# Altium project eps_alpha-test_boost-mppt.PrjPcb
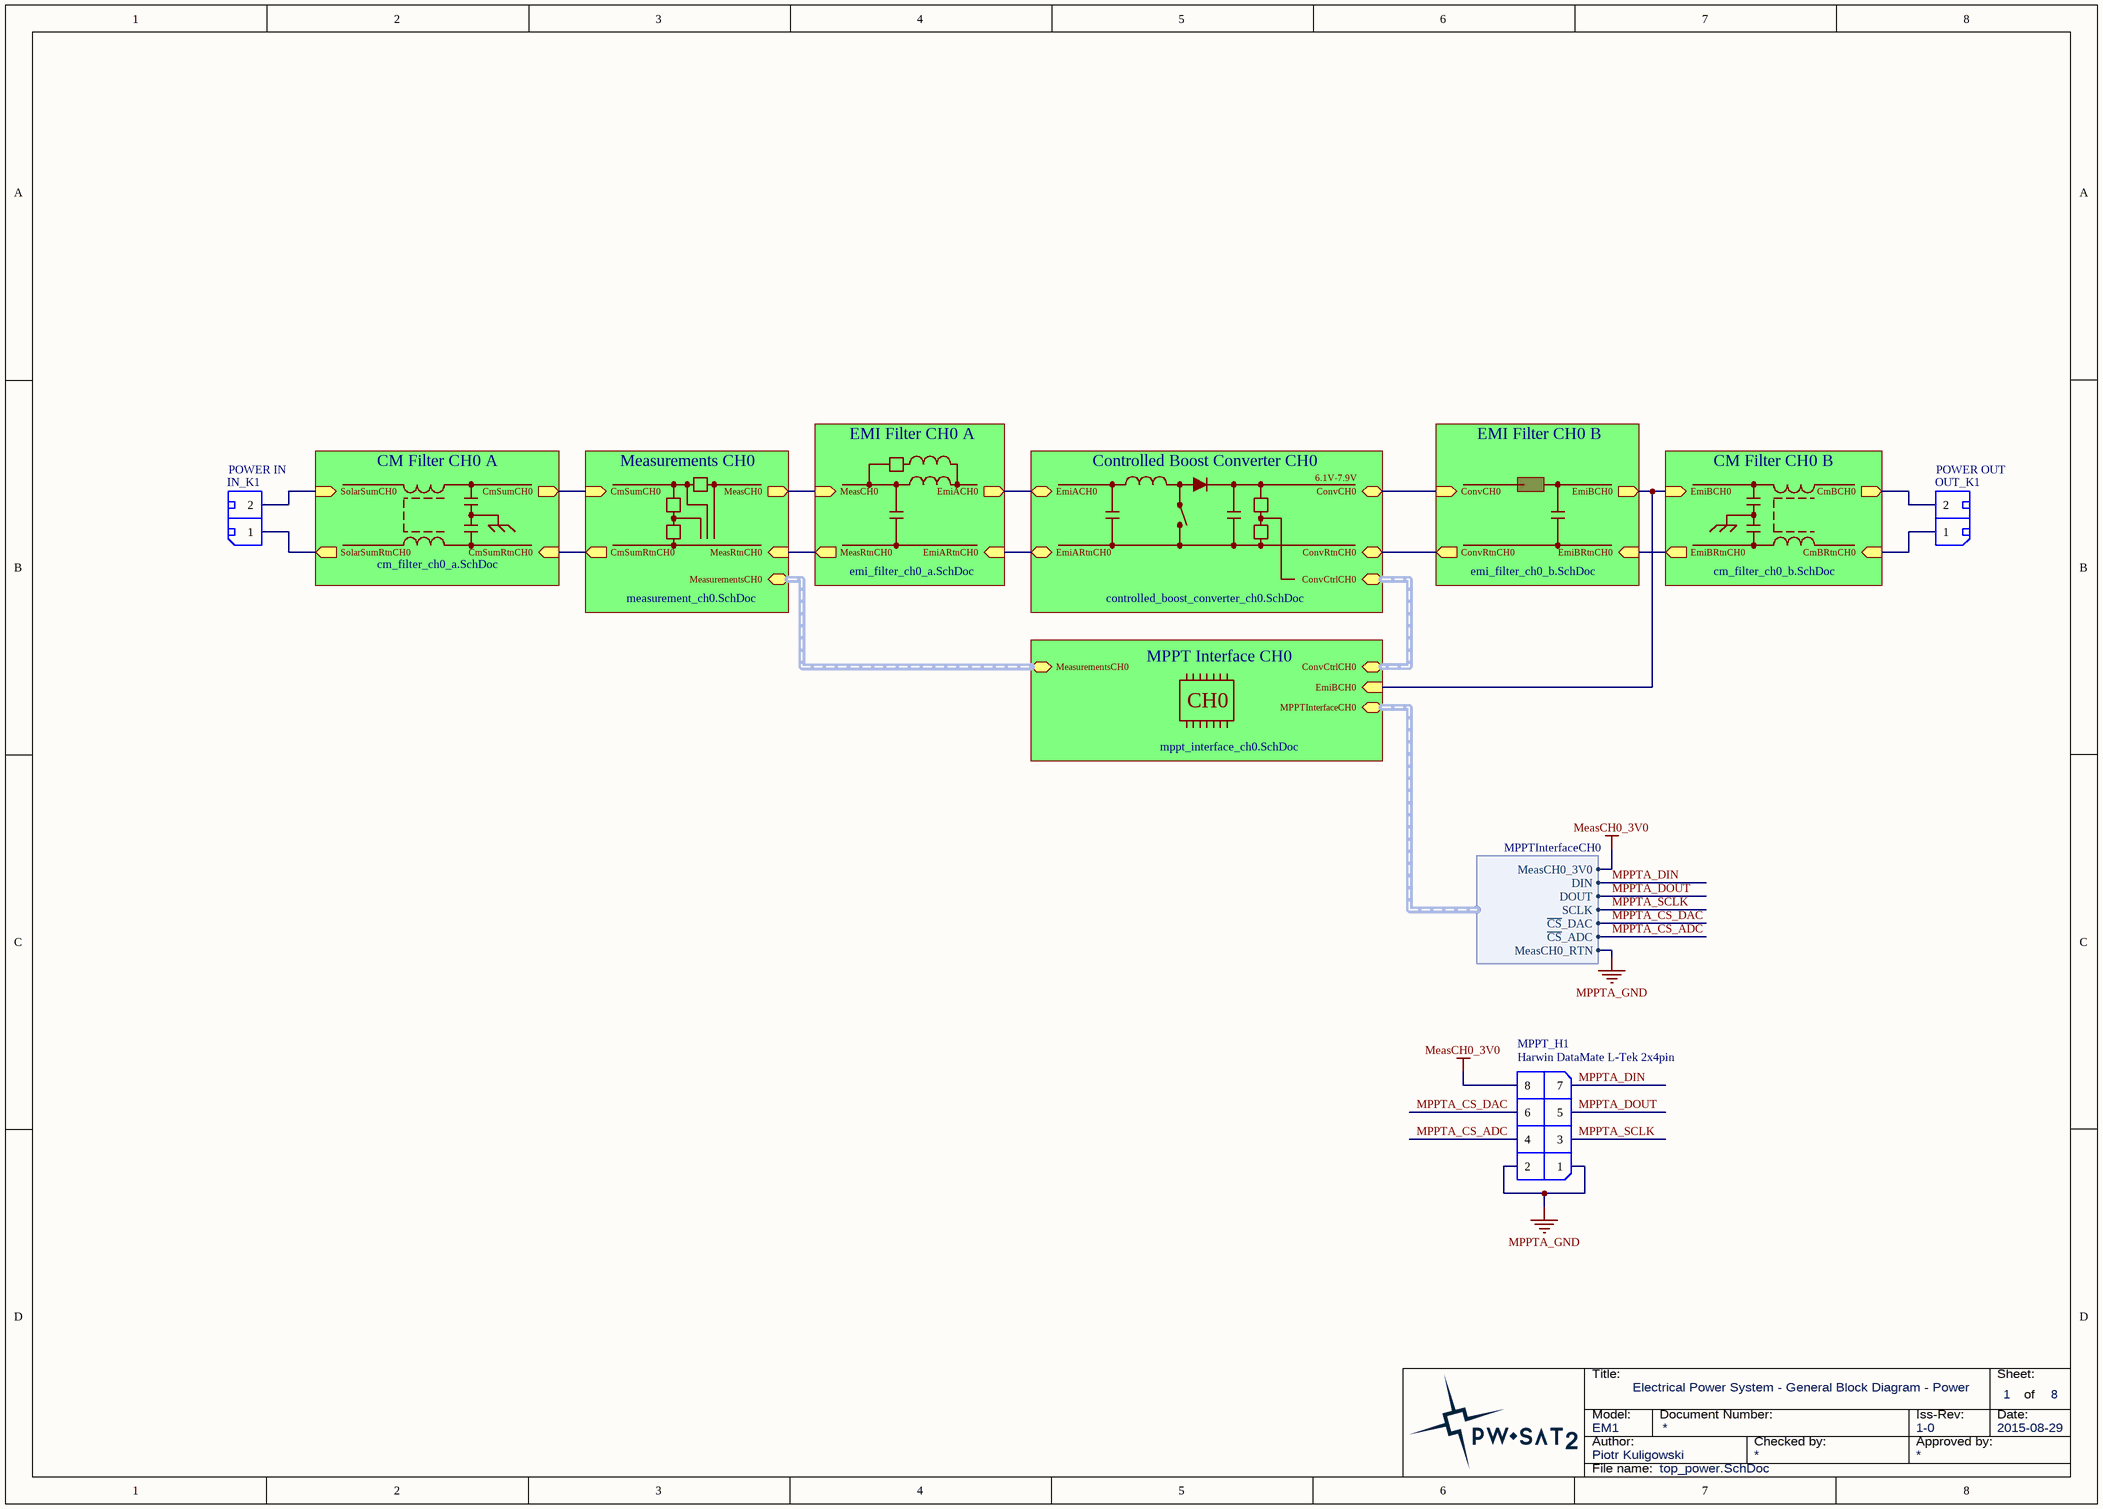
[diagram p0: top_power.SchDoc]
8 sheets, 91 parts. Net scope: hierarchical (ports join the sheet entries above them; power ports are global).
Board file: eps_alpha-test_boost-mppt.PcbDoc
Sheets:
  top_power.SchDoc
    Controlled Boost Converter CH0 = controlled_boost_converter_ch0.SchDoc
    CM Filter CH0 A = cm_filter_ch0_a.SchDoc
    MPPT Interface CH0 = mppt_interface_ch0.SchDoc
    Measurements CH0 = measurement_ch0.SchDoc
    EMI Filter CH0 A = emi_filter_ch0_a.SchDoc
    EMI Filter CH0 B = emi_filter_ch0_b.SchDoc
    CM Filter CH0 B = cm_filter_ch0_b.SchDoc

## Sheet top_power.SchDoc: Electrical Power System - General Block Diagram - Power
size A3; Date: 2015-08-29; Author: Piotr Kuligowski; Revision: 1-0; SheetNumber: 1; SheetTotal: 8; Model: EM1; PageSetup: Record=PageOptions|CenterHorizontal=True|CenterVertical=True|PrintScale=0.52|XCorrection=1.00|YCorrection=1.00|PrintKind=1|BorderSize=5000000|LeftOffset=0|BottomOffset=0|Orientation=2|PaperLength=4200|PaperWidth=2970|Scale=100|PaperSource=7|PrintQuality=600|MediaType=1|DitherType=10|PaperKind=A3|PrintScaleMode=1

### Parts
IN_K1  ProviderPartNumber: POWER IN  [TerminalBlock_Spring_2.54_2-R]  (hidden comment: TB-2.5-PD-xx)
MPPT_H1  Harwin DataMate L-Tek 2x4pin  [Harwin_Datamate_L-Tek_M80-8670805]
OUT_K1  ProviderPartNumber: POWER OUT  [TerminalBlock_Spring_2.54_2-R]  (hidden comment: TB-2.5-PD-xx)

### Sub-sheets
CM Filter CH0 A = cm_filter_ch0_a.SchDoc: CmSumCH0 (out), CmSumRtnCH0 (in), SolarSumCH0 (in), SolarSumRtnCH0 (out)
CM Filter CH0 B = cm_filter_ch0_b.SchDoc: CmBCH0 (out), CmBRtnCH0 (in), EmiBCH0 (in), EmiBRtnCH0 (out)
Controlled Boost Converter CH0 = controlled_boost_converter_ch0.SchDoc: ConvCH0, ConvRtnCH0, EmiACH0, EmiARtnCH0, ConvCtrlCH0 (harness ConvCtrlCH0)
EMI Filter CH0 A = emi_filter_ch0_a.SchDoc: EmiACH0 (out), EmiARtnCH0 (in), MeasCH0 (in), MeasRtnCH0 (out)
EMI Filter CH0 B = emi_filter_ch0_b.SchDoc: EmiBCH0 (out), EmiBRtnCH0 (in), ConvCH0 (in), ConvRtnCH0 (out)
Measurements CH0 = measurement_ch0.SchDoc: MeasCH0 (out), MeasRtnCH0 (in), CmSumCH0 (in), CmSumRtnCH0 (out), MeasurementsCH0 (harness MeasurementsCH0)
MPPT Interface CH0 = mppt_interface_ch0.SchDoc: MeasurementsCH0 (harness MeasurementsCH0), ConvCtrlCH0 (harness ConvCtrlCH0), MPPTInterfaceCH0 (harness MPPTInterfaceCH0), EmiBCH0 (in)

### Harnesses
MPPTInterfaceCH0: DIN, DOUT, SCLK, ~{CS}_DAC, ~{CS}_ADC, MeasCH0_3V0, MeasCH0_RTN

### Nets
MeasCH0_3V0: MPPT_H1.8 ; sheet MPPT Interface CH0/MPPTInterfaceCH0.MeasCH0_3V0
MPPTA_GND: MPPT_H1.1 MPPT_H1.2 ; sheet Controlled Boost Converter CH0/ConvRtnCH0, sheet Controlled Boost Converter CH0/EmiARtnCH0, sheet CM Filter CH0 A/CmSumRtnCH0, sheet Measurements CH0/MeasRtnCH0, sheet Measurements CH0/CmSumRtnCH0, sheet EMI Filter CH0 A/EmiARtnCH0, sheet EMI Filter CH0 A/MeasRtnCH0, sheet EMI Filter CH0 B/EmiBRtnCH0, sheet EMI Filter CH0 B/ConvRtnCH0, sheet CM Filter CH0 B/EmiBRtnCH0, sheet MPPT Interface CH0/MPPTInterfaceCH0.MeasCH0_RTN  [project net DCDCA_GND]
MPPTA_CS_ADC: MPPT_H1.4 ; sheet MPPT Interface CH0/MPPTInterfaceCH0.~{CS}_ADC
MPPTA_CS_DAC: MPPT_H1.6 ; sheet MPPT Interface CH0/MPPTInterfaceCH0.~{CS}_DAC
MPPTA_DIN: MPPT_H1.7 ; sheet MPPT Interface CH0/MPPTInterfaceCH0.DIN
MPPTA_DOUT: MPPT_H1.5 ; sheet MPPT Interface CH0/MPPTInterfaceCH0.DOUT
MPPTA_SCLK: MPPT_H1.3 ; sheet MPPT Interface CH0/MPPTInterfaceCH0.SCLK
NetCMAA_C1_1: sheet CM Filter CH0 A/CmSumCH0, sheet Measurements CH0/CmSumCH0
NetCMAA_T1_1: IN_K1.2 ; sheet CM Filter CH0 A/SolarSumCH0
NetCMAA_T1_2: IN_K1.1 ; sheet CM Filter CH0 A/SolarSumRtnCH0
NetCMAB_C1_1: sheet MPPT Interface CH0/EmiBCH0, sheet EMI Filter CH0 B/EmiBCH0, sheet CM Filter CH0 B/EmiBCH0
NetCMAB_T1_3: OUT_K1.1 ; sheet CM Filter CH0 B/CmBRtnCH0
NetCMAB_T1_4: OUT_K1.2 ; sheet CM Filter CH0 B/CmBCH0
NetDCDCA_C1_1: sheet Controlled Boost Converter CH0/EmiACH0, sheet EMI Filter CH0 A/EmiACH0
NetDCDCA_C4_1: sheet Controlled Boost Converter CH0/ConvCH0, sheet EMI Filter CH0 B/ConvCH0
NetEMIAA_C1_1: sheet Measurements CH0/MeasCH0, sheet EMI Filter CH0 A/MeasCH0

### Buses and harness runs
harness sheet Controlled Boost Converter CH0/ConvCtrlCH0 = sheet MPPT Interface CH0/ConvCtrlCH0
harness sheet Measurements CH0/MeasurementsCH0 = sheet MPPT Interface CH0/MeasurementsCH0

### Notes on the sheet
- 6.1V-7.9V
- CH0
- Title:
- Sheet:
- of
- Author:
- Model:
- Document Number:
- Checked by:
- Iss-Rev:
- Approved by:
- Date:
- File name:

### Library data of the parts
IN_K1 OUT_K1 = TerminalBlock_Spring_2.54_2-R: Terminal block with spring, 2-pin, 2.54mm pitch, right angle.; Provider: TME.eu; Value: TB-2.5-PD-xx
MPPT_H1 = Harwin_Datamate_L-Tek_2x4pin: Harwin DataMate L-Tek, 2mm pitch, 2x4pin.; Value: Harwin DataMate L-Tek 2x4pin

## Sheet controlled_boost_converter_ch0.SchDoc: Controlled Boost Converter CH0
size A3; Date: 2015-10-06; Author: Piotr Kuligowski; Revision: 1-0; SheetNumber: 5; SheetTotal: 8; Model: EM1
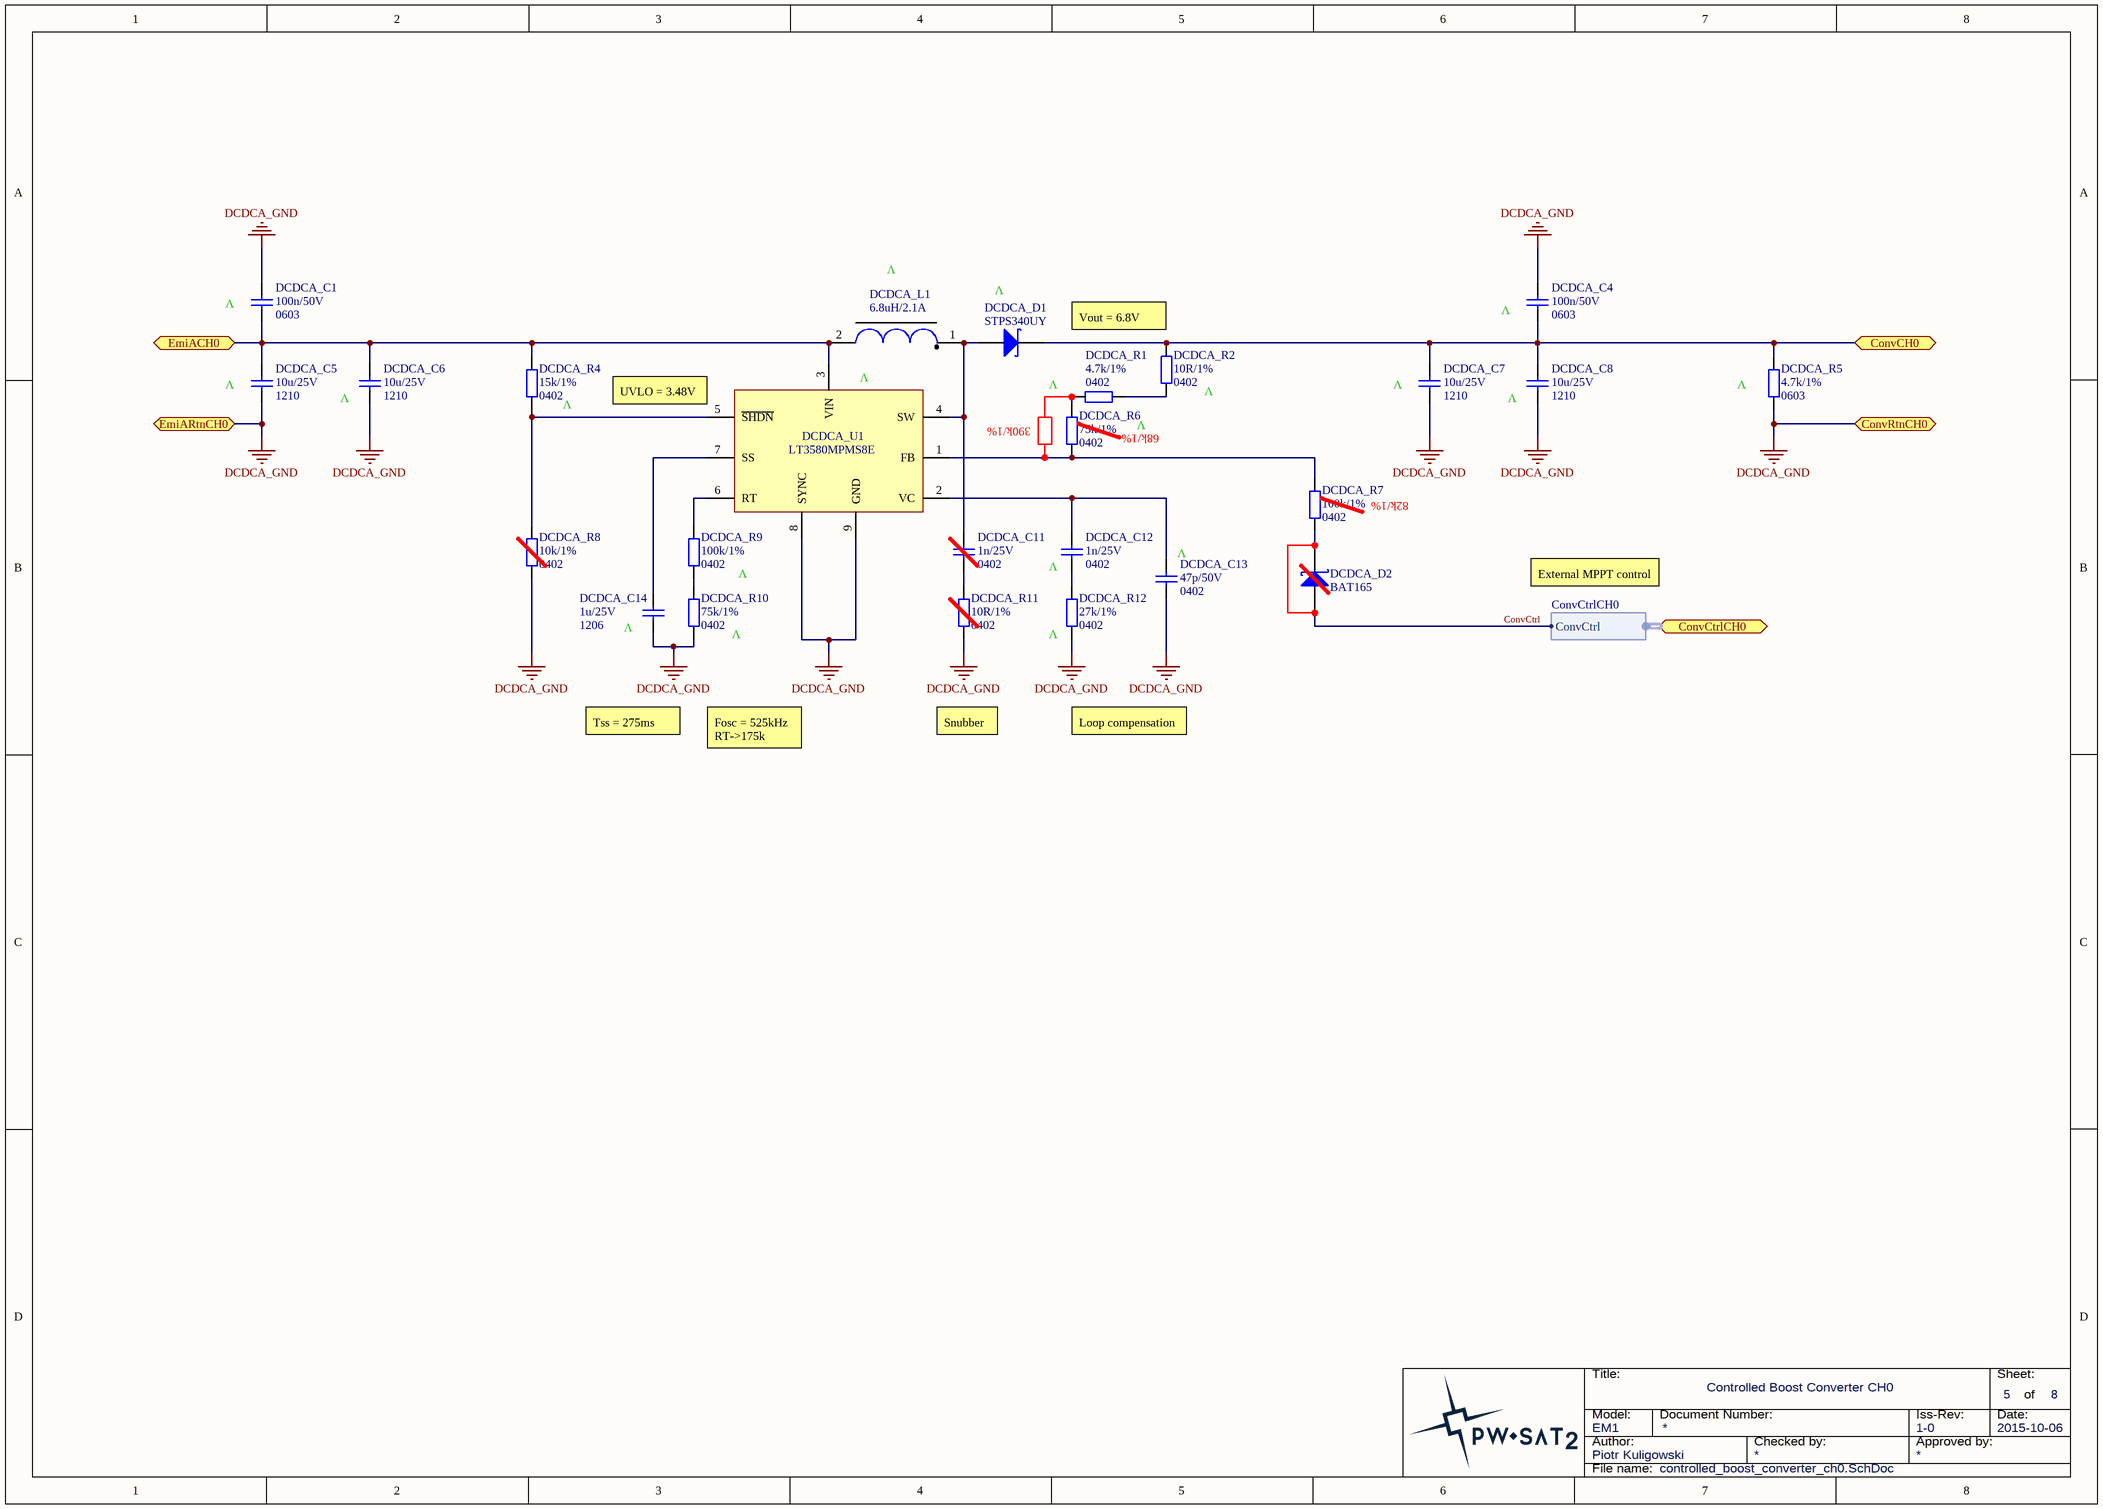
[diagram p1: controlled_boost_converter_ch0.SchDoc]

### Parts
DCDCA_C1  Package: 0603  [SMD_Capacitor_0603]  (hidden comment: 100n/50V)
DCDCA_C4  Package: 0603  [SMD_Capacitor_0603]  (hidden comment: 100n/50V)
DCDCA_C5  Package: 1210  [SMD_Capacitor_1210]  (hidden comment: 10u/25V)
DCDCA_C6  Package: 1210  [SMD_Capacitor_1210]  (hidden comment: 10u/25V)
DCDCA_C7  Package: 1210  [SMD_Capacitor_1210]  (hidden comment: 10u/25V)
DCDCA_C8  Package: 1210  [SMD_Capacitor_1210]  (hidden comment: 10u/25V)
DCDCA_C11  Package: 0402  [SMD_Capacitor_0402]  (hidden comment: 1n/25V)
DCDCA_C12  Package: 0402  [SMD_Capacitor_0402]  (hidden comment: 1n/25V)
DCDCA_C13  Package: 0402  [SMD_Capacitor_0402]  (hidden comment: 47p/50V)
DCDCA_C14  Package: 1206  [SMD_Capacitor_1206]  (hidden comment: 1u/25V)
DCDCA_D1  STPS340UY  [DO-214AA]
DCDCA_D2  BAT165  [SOD323]
DCDCA_L1  6.8uH/2.1A  [Coilcraft_MSS6132]
DCDCA_R1  Package: 0402  [SMD_Resistor_0402]  (hidden comment: 4.7k/1%)
DCDCA_R2  Package: 0402  [SMD_Resistor_0402]  (hidden comment: 10R/1%)
DCDCA_R4  Package: 0402  [SMD_Resistor_0402]  (hidden comment: 15k/1%)
DCDCA_R5  Package: 0603  [SMD_Resistor_0603]  (hidden comment: 4.7k/1%)
DCDCA_R6  Package: 0402  [SMD_Resistor_0402]  (hidden comment: 75k/1%)
DCDCA_R7  Package: 0402  [SMD_Resistor_0402]  (hidden comment: 100k/1%)
DCDCA_R8  Package: 0402  [SMD_Resistor_0402]  (hidden comment: 10k/1%)
DCDCA_R9  Package: 0402  [SMD_Resistor_0402]  (hidden comment: 100k/1%)
DCDCA_R10  Package: 0402  [SMD_Resistor_0402]  (hidden comment: 75k/1%)
DCDCA_R11  Package: 0402  [SMD_Resistor_0402]  (hidden comment: 10R/1%)
DCDCA_R12  Package: 0402  [SMD_Resistor_0402]  (hidden comment: 27k/1%)
DCDCA_U1  (no value)  [LT-MS8E-8-1880X1680TP_N]

### Ports
ConvCH0, ConvCtrlCH0 (harness ConvCtrlCH0), ConvRtnCH0, EmiACH0, EmiARtnCH0

### Harnesses
ConvCtrlCH0: ConvCtrl

### Nets
DCDCA_GND: DCDCA_C1.2 DCDCA_C4.2 DCDCA_C5.2 DCDCA_C6.2 DCDCA_C7.2 DCDCA_C8.2 DCDCA_C13.2 DCDCA_C14.2 DCDCA_R5.2 DCDCA_R8.2 DCDCA_R10.2 DCDCA_R11.2 DCDCA_R12.2 DCDCA_U1.8(SYNC) DCDCA_U1.9(GND) ; port EmiARtnCH0, port ConvRtnCH0
ConvCtrl: DCDCA_D2.A ; port ConvCtrlCH0.ConvCtrl
NetDCDCA_C1_1: DCDCA_C1.1 DCDCA_C5.1 DCDCA_C6.1 DCDCA_L1.2 DCDCA_R4.1 DCDCA_U1.3(VIN) ; port EmiACH0
NetDCDCA_C4_1: DCDCA_C4.1 DCDCA_C7.1 DCDCA_C8.1 DCDCA_D1.K DCDCA_R2.1 DCDCA_R5.1 ; port ConvCH0
NetDCDCA_C11_1: DCDCA_C11.1 DCDCA_D1.A DCDCA_L1.1 DCDCA_U1.4(SW)
NetDCDCA_C11_2: DCDCA_C11.2 DCDCA_R11.1
NetDCDCA_C12_1: DCDCA_C12.1 DCDCA_C13.1 DCDCA_U1.2(VC)
NetDCDCA_C12_2: DCDCA_C12.2 DCDCA_R12.1
NetDCDCA_C14_1: DCDCA_C14.1 DCDCA_U1.7(SS)
NetDCDCA_D2_K: DCDCA_D2.K DCDCA_R7.2
NetDCDCA_R1_1: DCDCA_R1.1 DCDCA_R6.1
NetDCDCA_R1_2: DCDCA_R1.2 DCDCA_R2.2
NetDCDCA_R4_2: DCDCA_R4.2 DCDCA_R8.1 DCDCA_U1.5(~{SHDN})
NetDCDCA_R6_2: DCDCA_R6.2 DCDCA_R7.1 DCDCA_U1.1(FB)
NetDCDCA_R9_1: DCDCA_R9.1 DCDCA_U1.6(RT)
NetDCDCA_R9_2: DCDCA_R9.2 DCDCA_R10.1

### Notes on the sheet
- (near DCDCA_C1) V
- V
- (near DCDCA_D1) V
- (near DCDCA_C4) V
- (near DCDCA_C5) V
- (near DCDCA_U1) V
- (near DCDCA_R2) Vout = 6.8V
- (near DCDCA_R2) V
- (near DCDCA_C7) V
- (near DCDCA_R5) V
- (near DCDCA_C6) V
- (near DCDCA_R4) V
- (near DCDCA_U1) UVLO = 3.48V
- 390k/1%
- 68k/1%
- (near DCDCA_C8) V
- 82k/1%
- (near DCDCA_C12) V
- (near DCDCA_C13) V
- External MPPT control
- (near DCDCA_C14) V
- (near DCDCA_R10) V
- (near DCDCA_R12) V
- Tss = 275ms
- Fosc = 525kHz
  RT->175k
- Snubber
- Loop compensation
- Title:
- Sheet:
- of
- Author:
- Model:
- Document Number:
- Checked by:
- Iss-Rev:
- Approved by:
- Date:
- File name:

### Library data of the parts
DCDCA_C1 DCDCA_C4 = Cer_C0603T104K5RALTU: Ceramic Cap Kemet COTS 100n/50V X7R 0603; Manufacturer: Kemet; ManufacturerPartNumber: C0603T104K5RALTU; Value: 100n/50V
DCDCA_C5-DCDCA_C8 = Cer_GCJ32ER71E106KA12L: Ceramic Cap Murata Automotive 10u/25V X7R 1210; Manufacturer: Murata; ManufacturerPartNumber: GCJ32ER71E106KA12L; Value: 10u/25V
DCDCA_C11 DCDCA_C12 = Cer_C0402T102K3GAL: Ceramic Cap Kemet COTS 1n/25V C0G 0402.; Manufacturer: Kemet; ManufacturerPartNumber: C0402T102K3GAL; Value: 1n/25V
DCDCA_C13 = Cer_GCM1555C1H470JA16D: Ceramic Cap Murata Automotive 47p/50V C0G 0402; Manufacturer: Murata; ManufacturerPartNumber: GCM1555C1H470JA16D; Value: 47p/50V
DCDCA_C14 = Cer_C1206T105K3RALTU: Ceramic Cap Kemet COTS 1u/25V X7R 1206; ManufacturerPartNumber: C1206T105K3RALTU; Manufacturer: Kemet; Value: 1u/25V
DCDCA_D1 = STPS340x: 3A/40V Power Schottky Rectifier.; Manufacturer: STMicroelectronics; Value: STPS340UY
DCDCA_D2 = BAT165: Madium Power AF Schottky 750mA 40V Diode; Manufacturer: Infineon; Value: BAT165
DCDCA_L1 = MSS6132-682MLx: Coilcraft MSS6132 Inductor, L=6.8uH, Irise20deg=2.1A, ESR=52mR, SRF=47MHz.; Manufacturer: Coilcraft; ManufacturerPartNumber: MSS6132-682MLx; Value: 6.8uH/2.1A
DCDCA_R1 = CRCW04024K70FKxxxx: 4.7k/1% Vishay CRCW 0402 Resistor. 63mW, 100ppm, 50V.; ManufacturerPartNumber: CRCW04024K70FKxxxx; Manufacturer: Vishay; Value: 4.7k/1%
DCDCA_R2 DCDCA_R11 = CRCW040210R0FKxxxx: 10R/1% Vishay CRCW 0402 Resistor. 63mW, 100ppm, 50V.; Manufacturer: Vishay; ManufacturerPartNumber: CRCW040210R0FKxxxx; Value: 10R/1%
DCDCA_R4 = CRCW040215K0FKxxxx: 15k/1% Vishay CRCW 0402 Resistor. 63mW, 100ppm, 50V.; Manufacturer: Vishay; ManufacturerPartNumber: CRCW040215K0FKxxxx; Value: 15k/1%
DCDCA_R5 = CRCW06034K70FKxxxx: 4.7k/1% Vishay CRCW 0603 Resistor. 100mW, 100ppm, 75V.; Manufacturer: Vishay; ManufactuerPartNumber: CRCW06034K70FKxxxx; Value: 4.7k/1%
DCDCA_R6 DCDCA_R10 = CRCW040275K0FKxxxx: 75k/1% Vishay CRCW 0402 Resistor. 63mW, 100ppm, 50V.; ManufacturerPartNumber: CRCW040275K0FK; Manufacturer: Vishay; Value: 75k/1%
DCDCA_R7 DCDCA_R9 = CRCW0402100KFKxxxx: 100k/1% Vishay CRCW 0402 Resistor. 63mW, 100ppm, 50V.; Manufacturer: Vishay; ManufacturerPartNumber: CRCW0402100KFKxxxx; Value: 100k/1%
DCDCA_R8 = CRCW040210K0FKxxxx: 10k/1% Vishay CRCW 0402 Resistor. 63mW, 100ppm, 50V.; Manufacturer: Vishay; ManufacturerPartNumber: CRCW040210K0FKxxxx; Value: 10k/1%
DCDCA_R12 = CRCW040227K0FKxxxx: 27k/1% Vishay CRCW 0402 Resistor. 63mW, 100ppm, 50V.; Manufacturer: Vishay; ManufacturerPartNumber: CRCW040227K0FKxxxx; Value: 27k/1%
DCDCA_U1 = LT3580MPMS8E: Boost Conv 2A, Soft-Start, Synchro; Manufacturer: Linear Technology; ManufacturerPartNumber: LT3580MPMS8E

## Sheet cm_filter_ch0_a.SchDoc: Common Mode Filter CH0 A
size A4; Date: 2015-02-21; Author: Piotr Kuligowski; Revision: 1-0; SheetNumber: 2; SheetTotal: 8; Model: EM1
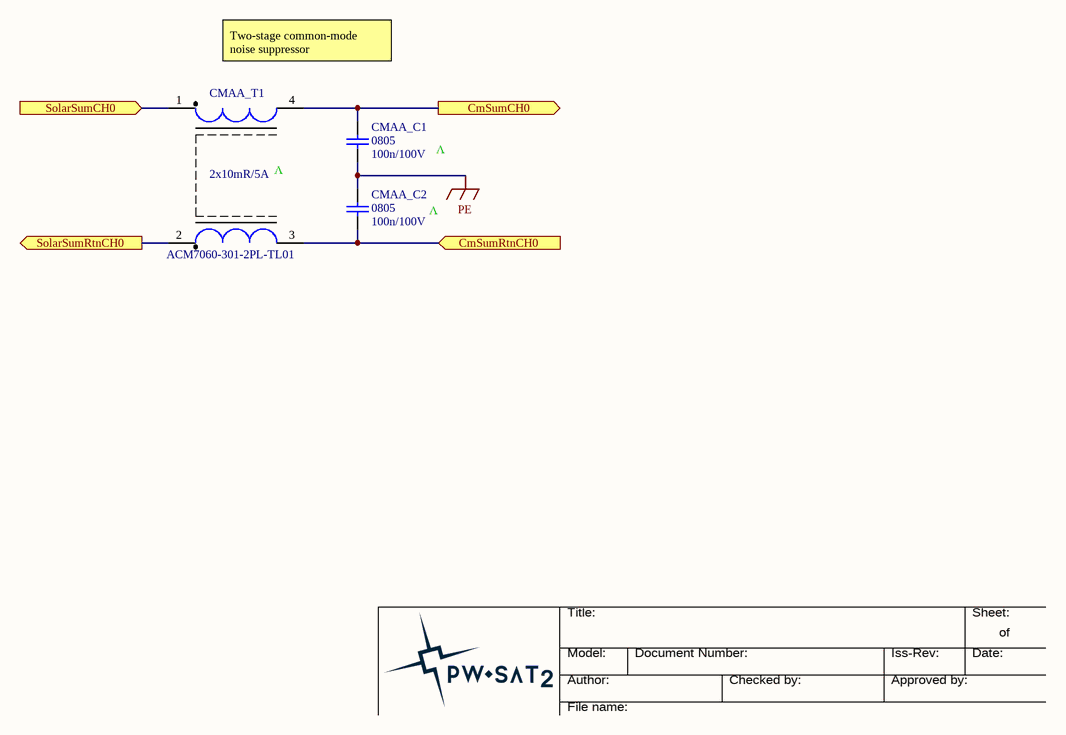
[diagram p2: cm_filter_ch0_a.SchDoc]

### Parts
CMAA_C1  Package: 0805  [SMD_Capacitor_0805]  (hidden comment: 100n/100V)
CMAA_C2  Package: 0805  [SMD_Capacitor_0805]  (hidden comment: 100n/100V)
CMAA_T1  2x10mR/5A  [TDK_ACM7060]

### Ports
CmSumCH0 (out), CmSumRtnCH0 (in), SolarSumCH0 (in), SolarSumRtnCH0 (out)

### Nets
DCDCA_GND: CMAA_C2.2 CMAA_T1.3 ; port CmSumRtnCH0
PE: CMAA_C1.2 CMAA_C2.1
NetCMAA_C1_1: CMAA_C1.1 CMAA_T1.4 ; port CmSumCH0
NetCMAA_T1_1: CMAA_T1.1 ; port SolarSumCH0
NetCMAA_T1_2: CMAA_T1.2 ; port SolarSumRtnCH0

### Notes on the sheet
- Two-stage common-mode noise suppressor
- (near CMAA_T1) V
- V
- Title:
- Sheet:
- of
- Author:
- Model:
- Document Number:
- Checked by:
- Iss-Rev:
- Approved by:
- Date:
- File name:

### Library data of the parts
CMAA_C1 CMAA_C2 = Cer_C0805T104K1RCLTU: Ceramic Cap Kemet COTS 100n/100V X7R 0805; ManufacturerPartNumber: C0805T104K1RCLTU; Manufacturer: Kemet; Value: 100n/100V
CMAA_T1 = ACM7060-301-2PL-TL01: TDK ACM7060-301 Common Mode Choke; Manufacturer: TDK; ManufacturerPartNumber: ACM7060-301-2PL-TL01; Value: 2x10mR/5A

## Sheet mppt_interface_ch0.SchDoc: MPPT Interface CH0
size A3; Date: 2015-10-14; Author: Piotr Kuligowski; Revision: 1-0; SheetNumber: 8; SheetTotal: 8; Model: EM1
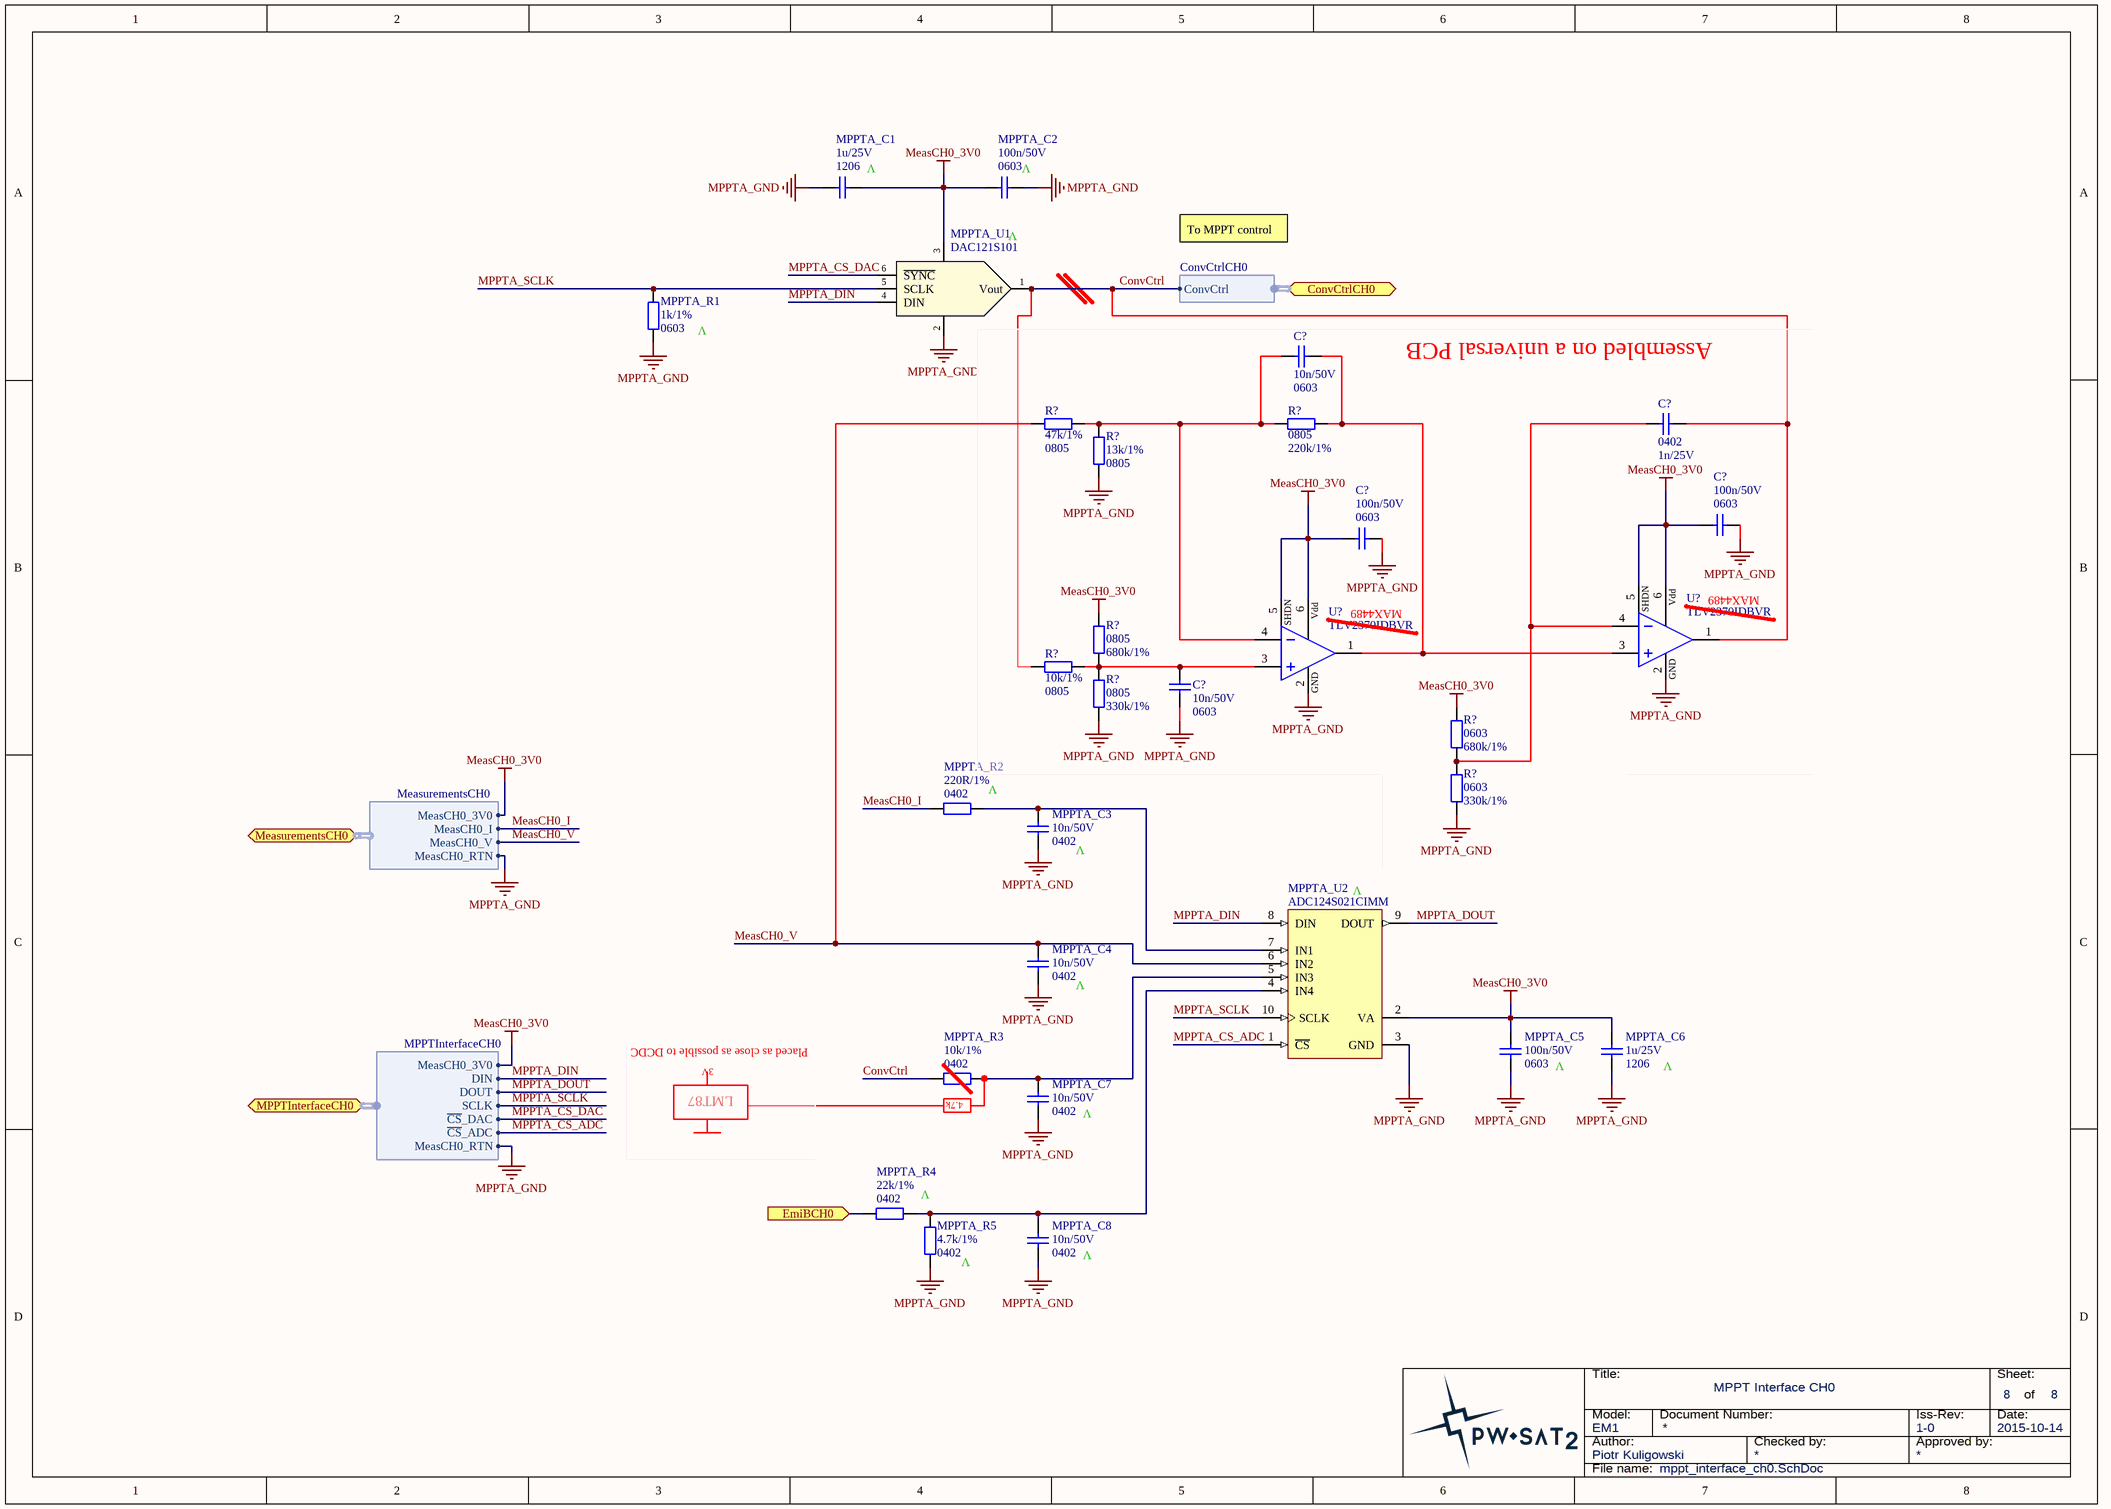
[diagram p3: mppt_interface_ch0.SchDoc]

### Parts
(Parts that share a designator on the sheet are numbered #1, #2 ... from top to bottom, then left to right.)
C?#1  Package: 0603  [SMD_Capacitor_0603]  (hidden comment: 10n/50V)
C?#2  Package: 0402  [SMD_Capacitor_0402]  (hidden comment: 1n/25V)
C?#3  Package: 0603  [SMD_Capacitor_0603]  (hidden comment: 100n/50V)
C?#4  Package: 0603  [SMD_Capacitor_0603]  (hidden comment: 100n/50V)
C?#5  Package: 0603  [SMD_Capacitor_0603]  (hidden comment: 10n/50V)
MPPTA_C1  Package: 1206  [SMD_Capacitor_1206]  (hidden comment: 1u/25V)
MPPTA_C2  Package: 0603  [SMD_Capacitor_0603]  (hidden comment: 100n/50V)
MPPTA_C3  Package: 0402  [SMD_Capacitor_0402]  (hidden comment: 10n/50V)
MPPTA_C4  Package: 0402  [SMD_Capacitor_0402]  (hidden comment: 10n/50V)
MPPTA_C5  Package: 0603  [SMD_Capacitor_0603]  (hidden comment: 100n/50V)
MPPTA_C6  Package: 1206  [SMD_Capacitor_1206]  (hidden comment: 1u/25V)
MPPTA_C7  Package: 0402  [SMD_Capacitor_0402]  (hidden comment: 10n/50V)
MPPTA_C8  Package: 0402  [SMD_Capacitor_0402]  (hidden comment: 10n/50V)
MPPTA_R1  Package: 0603  [SMD_Resistor_0603]  (hidden comment: 1k/1%)
MPPTA_R2  Package: 0402  [SMD_Resistor_0402]  (hidden comment: 220R/1%)
MPPTA_R3  Package: 0402  [SMD_Resistor_0402]  (hidden comment: 10k/1%)
MPPTA_R4  Package: 0402  [SMD_Resistor_0402]  (hidden comment: 22k/1%)
MPPTA_R5  Package: 0402  [SMD_Resistor_0402]  (hidden comment: 4.7k/1%)
MPPTA_U1  DAC121S101  [SOT23-6]
MPPTA_U2  ADC124S021CIMM  [MUB10A_L]
R?#1  Package: 0805  [SMD_Resistor_0805]  (hidden comment: 47k/1%)
R?#2  Package: 0805  [SMD_Resistor_0805]  (hidden comment: 220k/1%)
R?#3  Package: 0805  [SMD_Resistor_0805]  (hidden comment: 13k/1%)
R?#4  Package: 0805  [SMD_Resistor_0805]  (hidden comment: 680k/1%)
R?#5  Package: 0805  [SMD_Resistor_0805]  (hidden comment: 10k/1%)
R?#6  Package: 0805  [SMD_Resistor_0805]  (hidden comment: 330k/1%)
R?#7  Package: 0603  [SMD_Resistor_0603]  (hidden comment: 680k/1%)
R?#8  Package: 0603  [SMD_Resistor_0603]  (hidden comment: 330k/1%)
U?#1  (no value)  [SOT23-6]
U?#2  (no value)  [SOT23-6]

### Blocks framed on the sheet
Assembled on a universal PCB: C?#1-C?#5 R?#1-R?#7 U?#1 U?#2

### Ports
ConvCtrlCH0 (harness ConvCtrlCH0), EmiBCH0 (in), MeasurementsCH0 (harness MeasurementsCH0), MPPTInterfaceCH0 (harness MPPTInterfaceCH0)

### Harnesses
MeasurementsCH0: MeasCH0_RTN, MeasCH0_V, MeasCH0_I, MeasCH0_3V0
ConvCtrlCH0: ConvCtrl
MPPTInterfaceCH0: DIN, DOUT, SCLK, ~{CS}_DAC, ~{CS}_ADC, MeasCH0_3V0, MeasCH0_RTN

### Nets
MeasCH0_3V0: C?#3.1 C?#4.1 MPPTA_C1.2 MPPTA_C2.2 MPPTA_C5.1 MPPTA_C6.1 MPPTA_U1.3(Va) MPPTA_U2.2(VA) R?#4.1 R?#7.1 U?#1.5(SHDN) U?#1.6(Vdd) U?#2.5(SHDN) U?#2.6(Vdd) ; port MeasurementsCH0.MeasCH0_3V0, port MPPTInterfaceCH0.MeasCH0_3V0
MPPTA_GND: C?#3.2 C?#4.2 C?#5.1 MPPTA_C1.1 MPPTA_C2.1 MPPTA_C3.2 MPPTA_C4.2 MPPTA_C5.2 MPPTA_C6.2 MPPTA_C7.2 MPPTA_C8.2 MPPTA_R1.2 MPPTA_R5.2 MPPTA_U1.2(GND) MPPTA_U2.3(GND) R?#3.1 R?#6.2 R?#8.2 U?#1.2(GND) U?#2.2(GND) ; port MeasurementsCH0.MeasCH0_RTN, port MPPTInterfaceCH0.MeasCH0_RTN  [project net DCDCA_GND]
ConvCtrl: C?#2.2 MPPTA_R3.1 MPPTA_U1.1(Vout) R?#5.1 U?#1.1(OUT) ; port ConvCtrlCH0.ConvCtrl
MeasCH0_I: MPPTA_R2.1 ; port MeasurementsCH0.MeasCH0_I
MeasCH0_V: MPPTA_C4.1 MPPTA_U2.6(IN2) R?#1.1 ; port MeasurementsCH0.MeasCH0_V
MPPTA_CS_ADC: MPPTA_U2.1(~{CS}) ; port MPPTInterfaceCH0.~{CS}_ADC
MPPTA_CS_DAC: MPPTA_U1.6(~{SYNC}) ; port MPPTInterfaceCH0.~{CS}_DAC
MPPTA_DIN: MPPTA_U1.4(DIN) MPPTA_U2.8(DIN) ; port MPPTInterfaceCH0.DIN
MPPTA_DOUT: MPPTA_U2.9(DOUT) ; port MPPTInterfaceCH0.DOUT
MPPTA_SCLK: MPPTA_R1.1 MPPTA_U1.5(SCLK) MPPTA_U2.10(SCLK) ; port MPPTInterfaceCH0.SCLK
NetC?#1_1: C?#1.1 R?#1.2 R?#2.1 R?#3.2 U?#2.4(IN-)
NetC?#1_2: C?#1.2 R?#2.2 U?#1.3(IN+) U?#2.1(OUT)
NetC?#2_1: C?#2.1 R?#7.2 R?#8.1 U?#1.4(IN-)
NetC?#5_2: C?#5.2 R?#4.2 R?#5.2 R?#6.1 U?#2.3(IN+)
NetCMAB_C1_1: MPPTA_R4.1 ; port EmiBCH0
NetMPPTA_C3_1: MPPTA_C3.1 MPPTA_R2.2 MPPTA_U2.7(IN1)
NetMPPTA_C7_1: MPPTA_C7.1 MPPTA_R3.2 MPPTA_U2.5(IN3)
NetMPPTA_C8_1: MPPTA_C8.1 MPPTA_R4.2 MPPTA_R5.1 MPPTA_U2.4(IN4)

### Notes on the sheet
- (near MPPTA_C1) V
- (near MPPTA_C2) V
- (near MPPTA_U1) V
- To MPPT control
- V
- (near U?#1) MAX4489
- (near U?#2) MAX4489
- (near MPPTA_C3) V
- (near MPPTA_U2) V
- (near MPPTA_C4) V
- Placed as close as possible to DCDC
- 3V
- LMT87
- (near MPPTA_R3) 4.7k
- Title:
- Sheet:
- of
- Author:
- Model:
- Document Number:
- Checked by:
- Iss-Rev:
- Approved by:
- Date:
- File name:

### Library data of the parts
C?#1 C?#3-C?#5 MPPTA_C2 MPPTA_C5 = Cer_C0603T104K5RALTU: Ceramic Cap Kemet COTS 100n/50V X7R 0603; Manufacturer: Kemet; ManufacturerPartNumber: C0603T104K5RALTU
  C?#1 C?#5: Value: 10n/50V
  C?#3 C?#4 MPPTA_C2 MPPTA_C5: Value: 100n/50V
C?#2 = Cer_C0402T102K3GAL: Ceramic Cap Kemet COTS 1n/25V C0G 0402.; Manufacturer: Kemet; ManufacturerPartNumber: C0402T102K3GAL; Value: 1n/25V
MPPTA_C1 MPPTA_C6 = Cer_C1206T105K3RALTU: Ceramic Cap Kemet COTS 1u/25V X7R 1206; ManufacturerPartNumber: C1206T105K3RALTU; Manufacturer: Kemet; Value: 1u/25V
MPPTA_C3 MPPTA_C4 MPPTA_C7 MPPTA_C8 = Cer_C0402T103K5RALTU: Ceramic Cap Kemet COTS 10n/50V X7R 0402; ManufacturerPartNumber: C0402T103K5RALTU; Manufacturer: Kemet; Value: 10n/50V
MPPTA_R1 = CRCW06031K00FKxxxx: 1k/1% Vishay CRCW 0603 Resistor. 100mW, 100ppm, 75V.; Manufacturer: Vishay; ManufacturerPartNumber: CRCW06031K00FKxxxx; Value: 1k/1%
MPPTA_R2 = CRCW0402220RFKxxxx: 220R/1% Vishay CRCW 0402 Resistor. 63mW, 100ppm, 50V.; Manufacturer: Vishay; ManufacturerPartNumber: CRCW0402220RFKxxxx; Value: 220R/1%
MPPTA_R3 = CRCW040210K0FKxxxx: as DCDCA_R8 on sheet controlled_boost_converter_ch0; Manufacturer: Vishay; ManufacturerPartNumber: CRCW040210K0FKxxxx; Value: 10k/1%
MPPTA_R4 = CRCW040222K0FKxxxx: 22k/1% Vishay CRCW 0402 Resistor. 63mW, 100ppm, 50V.; Manufacturer: Vishay; ManufacturerPartNumber: CRCW040222K0FKxxxx; Value: 22k/1%
MPPTA_R5 = CRCW04024K70FKxxxx: as DCDCA_R1 on sheet controlled_boost_converter_ch0; ManufacturerPartNumber: CRCW04024K70FKxxxx; Manufacturer: Vishay; Value: 4.7k/1%
MPPTA_U1 = DAC121S101: 12-Bit Micro Power, RRO Digital-to-Analog Converter.; Manufacturer: Texas Instruments; Value: DAC121S101
MPPTA_U2 = ADC124S021CIMM/NOPB: Manufacturer: Texas Instruments; ManufacturerPartNumber: ADC124S021CIMM/NOPB; Value: ADC124S021CIMM
R?#1 R?#3 R?#5 = CRCW080510K0FKxxxx: 10k/1% Vishay CRCW 0805 Resistor. 125mW, 100ppm, 150V.; Manufacturer: Vishay; ManufacturerPartNumber: CRCW080510K0FKxxxx
  R?#1: Value: 47k/1%
  R?#3: Value: 13k/1%
  R?#5: Value: 10k/1%
R?#2 R?#4 R?#6 = CRCW0805220KFKxxxx: 220k/1% Vishay CRCW 0805 Resistor. 125mW, 100ppm, 150V.; ManufacturerPartNumber: CRCW0805220KFKxxxx; Manufacturer: Vishay
  R?#2: Value: 220k/1%
  R?#4: Value: 680k/1%
  R?#6: Value: 330k/1%
R?#7 = CRCW06032K20FKxxxx: 2.2k/1% Vishay CRCW 0603 Resistor. 100mW, 100ppm, 75V.; ManufacturerPartNumber: CRCW06032K20FKxxxx; Manufacturer: Vishay; Value: 680k/1%
R?#8 = CRCW06031K10FKxxxx: 1.1k/1% Vishay CRCW 0603 Resistor. 100mW, 100ppm, 75V.; ManufacturerPartNumber: CRCW06031K10FKxxxx; Manufacturer: Vishay; Value: 330k/1%
U?#1 U?#2 = TLV2370IDBVR: 3-MHz Rail-to-Rail In/Out Single Operational Amplifier; Manufacturer: Texas Instruments; HelpUrl: http://www.ti.com/lit/ds/symlink/tlv2370.pdf; ManufacturerPartNumber: TLV2370IDBVR

## Sheet measurement_ch0.SchDoc: Measurements CH0
size A4; Date: 2015-02-22; Author: Piotr Kuligowski; Revision: 1-0; SheetNumber: 3; SheetTotal: 8; Model: EM1
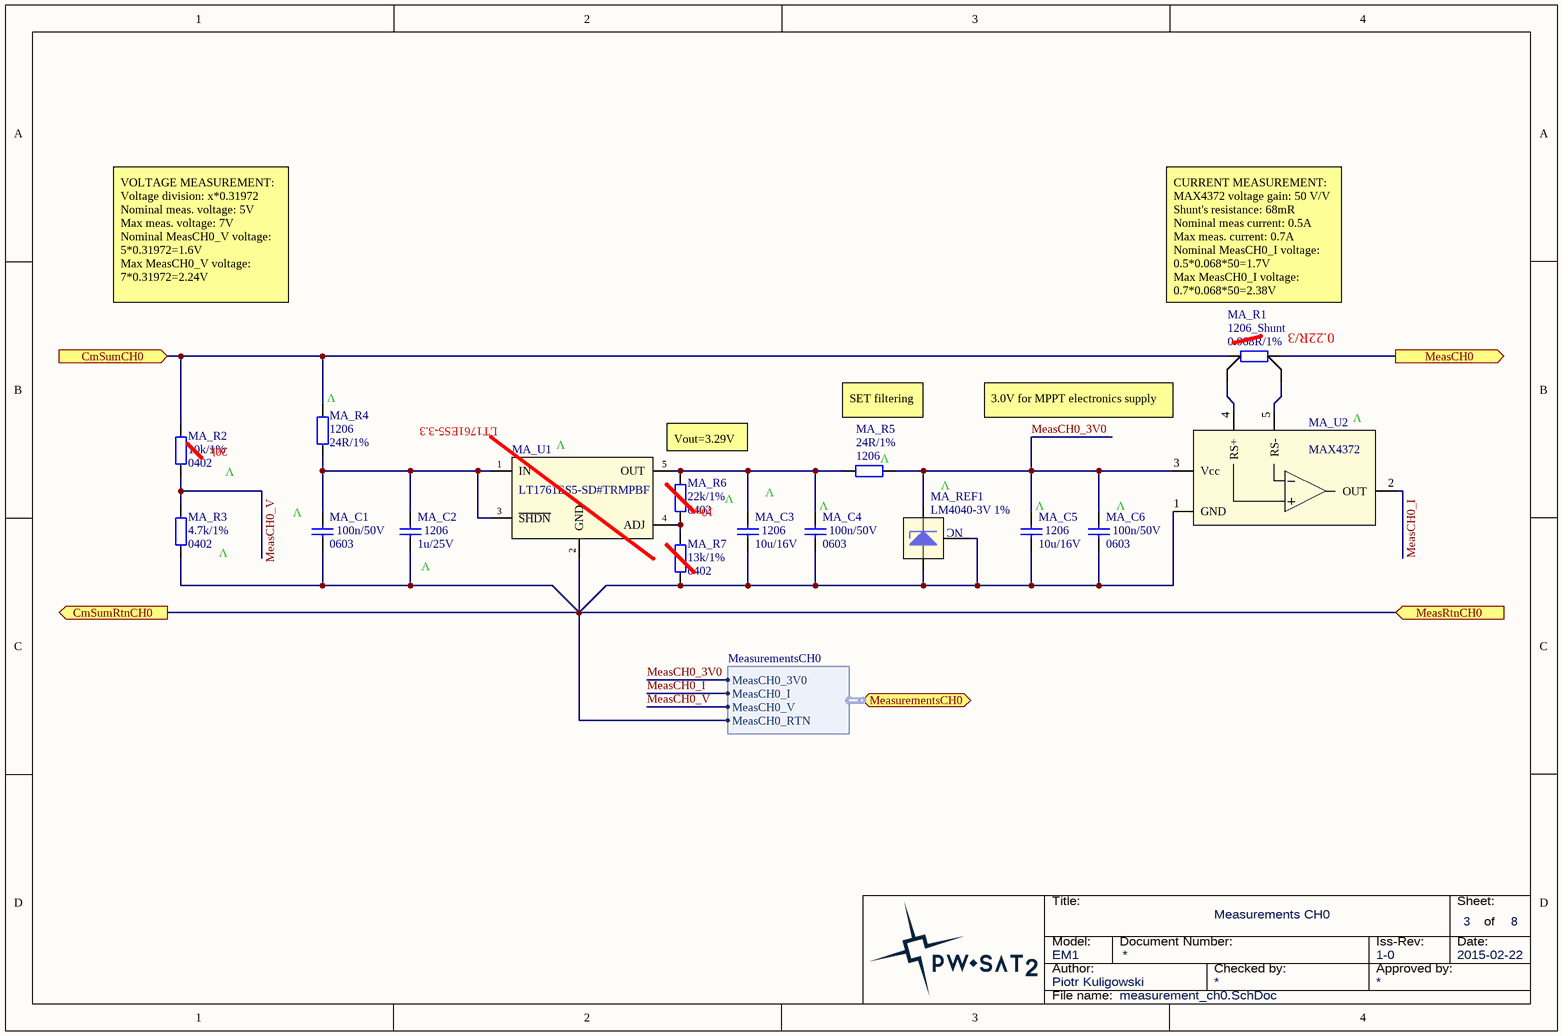
[diagram p4: measurement_ch0.SchDoc]

### Parts
MA_C1  Package: 0603  [SMD_Capacitor_0603]  (hidden comment: 100n/50V)
MA_C2  Package: 1206  [SMD_Capacitor_1206]  (hidden comment: 1u/25V)
MA_C3  Packge: 1206  [SMD_Capacitor_1206]  (hidden comment: 10u/16V)
MA_C4  Package: 0603  [SMD_Capacitor_0603]  (hidden comment: 100n/50V)
MA_C5  Packge: 1206  [SMD_Capacitor_1206]  (hidden comment: 10u/16V)
MA_C6  Package: 0603  [SMD_Capacitor_0603]  (hidden comment: 100n/50V)
MA_R1  Package: 1206_Shunt  [SMD_Resistor-Shunt_1206]  (hidden comment: 0.068R/1%)
MA_R2  Package: 0402  [SMD_Resistor_0402]  (hidden comment: 10k/1%)
MA_R3  Package: 0402  [SMD_Resistor_0402]  (hidden comment: 4.7k/1%)
MA_R4  Package: 1206  [SMD_Resistor_1206]  (hidden comment: 24R/1%)
MA_R5  Package: 1206  [SMD_Resistor_1206]  (hidden comment: 24R/1%)
MA_R6  Package: 0402  [SMD_Resistor_0402]  (hidden comment: 22k/1%)
MA_R7  Package: 0402  [SMD_Resistor_0402]  (hidden comment: 13k/1%)
MA_REF1  LM4040-3V 1%  [SOT23-3]
MA_U1  LT1761ES5-SD#TRMPBF  [SOT23-5]
MA_U2  MAX4372  [SOT23-5]

### Ports
CmSumCH0 (in), CmSumRtnCH0 (out), MeasCH0 (out), MeasRtnCH0 (in), MeasurementsCH0 (harness MeasurementsCH0)

### Harnesses
MeasurementsCH0: MeasCH0_RTN, MeasCH0_V, MeasCH0_I, MeasCH0_3V0

### Nets
DCDCA_GND: MA_C1.2 MA_C2.2 MA_C3.2 MA_C4.2 MA_C5.2 MA_C6.2 MA_R3.2 MA_R7.2 MA_REF1.2(A) MA_REF1.3(NC) MA_U1.2(GND) MA_U2.1(GND) ; port MeasRtnCH0, port CmSumRtnCH0, port MeasurementsCH0.MeasCH0_RTN
MeasCH0_3V0: MA_C5.1 MA_C6.1 MA_R5.2 MA_REF1.1(K) MA_U2.3(Vcc) ; port MeasurementsCH0.MeasCH0_3V0
MeasCH0_I: MA_U2.2(OUT) ; port MeasurementsCH0.MeasCH0_I
MeasCH0_V: MA_R2.2 MA_R3.1 ; port MeasurementsCH0.MeasCH0_V
NetCMAA_C1_1: MA_R1.1 MA_R2.1 MA_R4.1 ; port CmSumCH0
NetEMIAA_C1_1: MA_R1.4 ; port MeasCH0
NetMA_C1_1: MA_C1.1 MA_C2.1 MA_R4.2 MA_U1.1(IN) MA_U1.3(~{SHDN})
NetMA_C3_1: MA_C3.1 MA_C4.1 MA_R5.1 MA_R6.1 MA_U1.5(OUT)
NetMA_R1_2: MA_R1.2 MA_U2.4(RS+)
NetMA_R1_3: MA_R1.3 MA_U2.5(RS-)
NetMA_R6_2: MA_R6.2 MA_R7.1 MA_U1.4(ADJ)

### Notes on the sheet
- VOLTAGE MEASUREMENT:
  Voltage division: x*0.31972
  Nominal meas. voltage: 5V
  Max meas. voltage: 7V
  Nominal MeasCH0_V voltage: 5*0.31972=1.6V
  Max MeasCH0_V voltage: 7*0.31972=2.24V
- CURRENT MEASUREMENT:
  MAX4372 voltage gain: 50 V/V
  Shunt's resistance: 68mR
  Nominal meas current: 0.5A
  Max meas. current: 0.7A
  Nominal MeasCH0_I voltage: 0.5*0.068*50=1.7V
  Max MeasCH0_I voltage: 0.7*0.068*50=2.38V
- (near MA_R4) V
- (near MA_R1) 0.22R/3
- (near MA_R2) 20k
- (near MA_U1) LT1761ES5-3.3
- (near MA_U1) V
- Vout=3.29V
- SET filtering
- (near MA_R5) V
- (near MA_U2) 3.0V for MPPT electronics supply
- (near MA_U2) V
- V
- (near MA_C1) V
- (near MA_C3) 10n
- (near MA_C3) V
- (near MA_C4) V
- (near MA_REF1) V
- (near MA_C5) V
- (near MA_C6) V
- (near MA_R3) V
- (near MA_C2) V
- Title:
- Sheet:
- of
- Author:
- Model:
- Document Number:
- Checked by:
- Iss-Rev:
- Approved by:
- Date:
- File name:

### Library data of the parts
MA_C1 MA_C4 MA_C6 = Cer_C0603T104K5RALTU: Ceramic Cap Kemet COTS 100n/50V X7R 0603; Manufacturer: Kemet; ManufacturerPartNumber: C0603T104K5RALTU; Value: 100n/50V
MA_C2 = Cer_C1206T105K3RALTU: Ceramic Cap Kemet COTS 1u/25V X7R 1206; ManufacturerPartNumber: C1206T105K3RALTU; Manufacturer: Kemet; Value: 1u/25V
MA_C3 MA_C5 = Cer_C1206T106K4RACTU: Ceramic Cap Kemet COTS 10u/16V X7R 1206; ManufacturerPartNumber: C1206T106K4RACTU; Manufacturer: Kemet; Value: 10u/16V
MA_R1 = ERJ-8BWFR068V: Panasonic Resistor 68mR 1% 1206 1W; Manufacturer: Panasonic; ManufacturerPartNumber: ERJ-8BWFR068V; Value: 0.068R/1%
MA_R2 = CRCW040210K0FKxxxx: as DCDCA_R8 on sheet controlled_boost_converter_ch0; Manufacturer: Vishay; ManufacturerPartNumber: CRCW040210K0FKxxxx; Value: 10k/1%
MA_R3 = CRCW04024K70FKxxxx: as DCDCA_R1 on sheet controlled_boost_converter_ch0; ManufacturerPartNumber: CRCW04024K70FKxxxx; Manufacturer: Vishay; Value: 4.7k/1%
MA_R4 MA_R5 = CRCW120624R0FKxxxx: 24R/1% Vishay CRCW 1206 Resistor. 250mW, 100ppm, 200V.; ManufacturerPartNumber: CRCW120624R0FKxxxx; Manufacturer: Vishay; Value: 24R/1%
MA_R6 = CRCW040222K0FKxxxx: as MPPTA_R4 on sheet mppt_interface_ch0; Manufacturer: Vishay; ManufacturerPartNumber: CRCW040222K0FKxxxx; Value: 22k/1%
MA_R7 = CRCW040213K0FKxxxx: 13k/1% Vishay CRCW 0402 Resistor. 63mW, 100ppm, 50V.; ManufacturerPartNumber: CRCW040213K0FKxxxx; Manufacturer: Vishay; Value: 13k/1%
MA_REF1 = LM4040DIM3-3.0: Shunt V-REF, 3V, 1%, SOT23-3; Manufacturer: Texas Instruments; ManufacturerPartNumber: LM4040DIM3-3.0; Value: LM4040-3V 1%
MA_U1 = LT1761ES5-SD#TRMPBF: 100mA, Regulated, Low Noise, LDO Micropower Regulator in TSOT-23; Manufacturer: Linear Technology; Value: LT1761ES5-SD#TRMPBF
MA_U2 = MAX4372: High-Side Current-Sense Amplifier with Voltage Output; Manufacturer: Maxim Integrated Products; Value: MAX4372

## Sheet emi_filter_ch0_a.SchDoc: EMI Filter CH0 A
size A4; Date: 2015-10-11; Author: Piotr Kuligowski; Revision: 1-0; SheetNumber: 4; SheetTotal: 8; Model: EM1
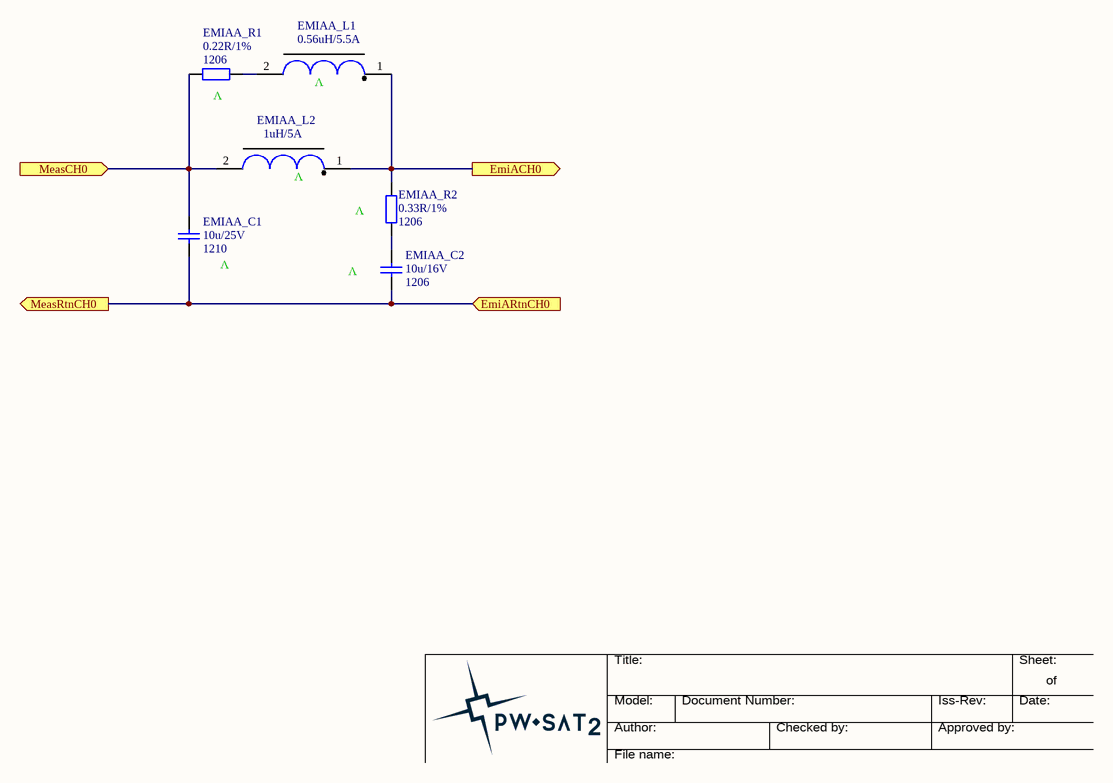
[diagram p5: emi_filter_ch0_a.SchDoc]

### Parts
EMIAA_C1  Package: 1210  [SMD_Capacitor_1210]  (hidden comment: 10u/25V)
EMIAA_C2  Packge: 1206  [SMD_Capacitor_1206]  (hidden comment: 10u/16V)
EMIAA_L1  0.56uH/5.5A  [Vishay_IHLP1212]
EMIAA_L2  1uH/5A  [Vishay_IHLP1212]
EMIAA_R1  Package: 1206  [SMD_Resistor_1206]  (hidden comment: 0.22R/1%)
EMIAA_R2  Package: 1206  [SMD_Resistor_1206]  (hidden comment: 0.33R/1%)

### Ports
EmiACH0 (out), EmiARtnCH0 (in), MeasCH0 (in), MeasRtnCH0 (out)

### Nets
DCDCA_GND: EMIAA_C1.2 EMIAA_C2.2 ; port MeasRtnCH0, port EmiARtnCH0
NetDCDCA_C1_1: EMIAA_L1.1 EMIAA_L2.1 EMIAA_R2.2 ; port EmiACH0
NetEMIAA_C1_1: EMIAA_C1.1 EMIAA_L2.2 EMIAA_R1.1 ; port MeasCH0
NetEMIAA_C2_1: EMIAA_C2.1 EMIAA_R2.1
NetEMIAA_L1_2: EMIAA_L1.2 EMIAA_R1.2

### Notes on the sheet
- (near EMIAA_L1) V
- (near EMIAA_R1) V
- (near EMIAA_L2) V
- (near EMIAA_R2) V
- (near EMIAA_C1) V
- (near EMIAA_C2) V
- Title:
- Sheet:
- of
- Author:
- Model:
- Document Number:
- Checked by:
- Iss-Rev:
- Approved by:
- Date:
- File name:

### Library data of the parts
EMIAA_C1 = Cer_GCJ32ER71E106KA12L: as DCDCA_C5 on sheet controlled_boost_converter_ch0; Manufacturer: Murata; ManufacturerPartNumber: GCJ32ER71E106KA12L; Value: 10u/25V
EMIAA_C2 = Cer_C1206T106K4RACTU: Ceramic Cap Kemet COTS 10u/16V X7R 1206; ManufacturerPartNumber: C1206T106K4RACTU; Manufacturer: Kemet; Value: 10u/16V
EMIAA_L1 = IHLP1212BZERR56M11: Vishay IHLP1212 Inductor, L=0.56uH, Irise40deg=5.5A, ESR=16mR, SRF=1MHz.; Manufacturer: Vishay; ManufacturerPartNumber: IHLP1212BZERR56M11; Value: 0.56uH/5.5A
EMIAA_L2 = IHLP1212BZER1R0M11: Vishay IHLP1212 Inductor, L=1uH, Irise40deg=5A, ESR=20mR, SRF=1MHz.; Manufacturer: Vishay; ManufacturerPartNumber: IHLP1212BZER1R0M11; Value: 1uH/5A
EMIAA_R1 = ERJ-8BQFR22V: Panasonic Resistor 0.22R 1% 1206 330mW; Manufacturer: Panasonic; ManufacturerPartNumber: ERJ-8BQFR22V; Value: 0.22R/1%
EMIAA_R2 = ERJ-8BQFR33V: Panasonic Resistor 0.33R 1% 1206 330mW; Manufacturer: Panasonic; ManufacturerPartNumber: ERJ-8BQFR33V; Value: 0.33R/1%

## Sheet emi_filter_ch0_b.SchDoc: EMI Filter CH0 B
size A4; Date: 2015-10-11; Author: Piotr Kuligowski; Revision: 1-0; SheetNumber: 6; SheetTotal: 8; Model: EM1
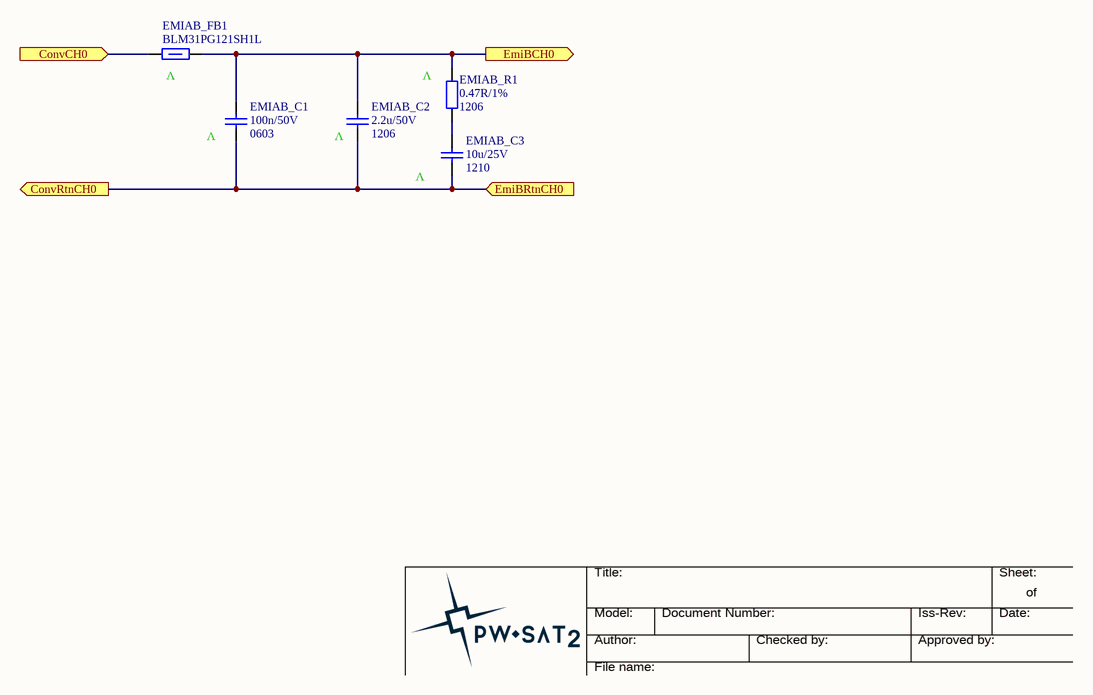
[diagram p6: emi_filter_ch0_b.SchDoc]

### Parts
EMIAB_C1  Package: 0603  [SMD_Capacitor_0603]  (hidden comment: 100n/50V)
EMIAB_C2  Package: 1206  [SMD_Capacitor_1206]  (hidden comment: 2.2u/50V)
EMIAB_C3  Package: 1210  [SMD_Capacitor_1210]  (hidden comment: 10u/25V)
EMIAB_FB1  120R/100MHz  [SMD_FerriteBead_1206]  (value not drawn)
EMIAB_R1  Package: 1206  [SMD_Resistor_1206]  (hidden comment: 0.47R/1%)

### Ports
ConvCH0 (in), ConvRtnCH0 (out), EmiBCH0 (out), EmiBRtnCH0 (in)

### Nets
DCDCA_GND: EMIAB_C1.2 EMIAB_C2.2 EMIAB_C3.2 ; port ConvRtnCH0, port EmiBRtnCH0
NetCMAB_C1_1: EMIAB_C1.1 EMIAB_C2.1 EMIAB_FB1.1 EMIAB_R1.2 ; port EmiBCH0
NetDCDCA_C4_1: EMIAB_FB1.2 ; port ConvCH0
NetEMIAB_C3_1: EMIAB_C3.1 EMIAB_R1.1

### Notes on the sheet
- (near EMIAB_FB1) V
- (near EMIAB_R1) V
- (near EMIAB_C1) V
- (near EMIAB_C2) V
- (near EMIAB_C3) V
- Title:
- Sheet:
- of
- Author:
- Model:
- Document Number:
- Checked by:
- Iss-Rev:
- Approved by:
- Date:
- File name:

### Library data of the parts
EMIAB_C1 = Cer_C0603T104K5RALTU: Ceramic Cap Kemet COTS 100n/50V X7R 0603; Manufacturer: Kemet; ManufacturerPartNumber: C0603T104K5RALTU; Value: 100n/50V
EMIAB_C2 = Cer_GCJ31CR71H225KA12L: Ceramic Cap Murata Automotive 2.2u/50V X7R 1206; Manufacturer: Murata; ManufacturerPartNumber: GCJ31CR71H225KA12L; Value: 2.2u/50V
EMIAB_C3 = Cer_GCJ32ER71E106KA12L: as DCDCA_C5 on sheet controlled_boost_converter_ch0; Manufacturer: Murata; ManufacturerPartNumber: GCJ32ER71E106KA12L; Value: 10u/25V
EMIAB_FB1 = BLM31PG121SH1L: Ferrite bead, 1206, 0.02HM, 3.5A.; Manufacturer: Murata; Current Rating: 3.5A; Series Resistance DC: 0.02R; Package: 1206; Value: 120R/100MHz; ManufacturerPartNumber: BLM31PG121SH1L
EMIAB_R1 = ERJ-8BQFR47V: Panasonic Resistor 0.47R 1% 1206 330mW; ManufacturerPartNumber: ERJ-8BQFR47V; Manufacturer: Panasonic; Value: 0.47R/1%

## Sheet cm_filter_ch0_b.SchDoc: Common Mode Filter CH0 B
size A4; Date: 2015-02-21; Author: Piotr Kuligowski; Revision: 1-0; SheetNumber: 7; SheetTotal: 8; Model: EM1
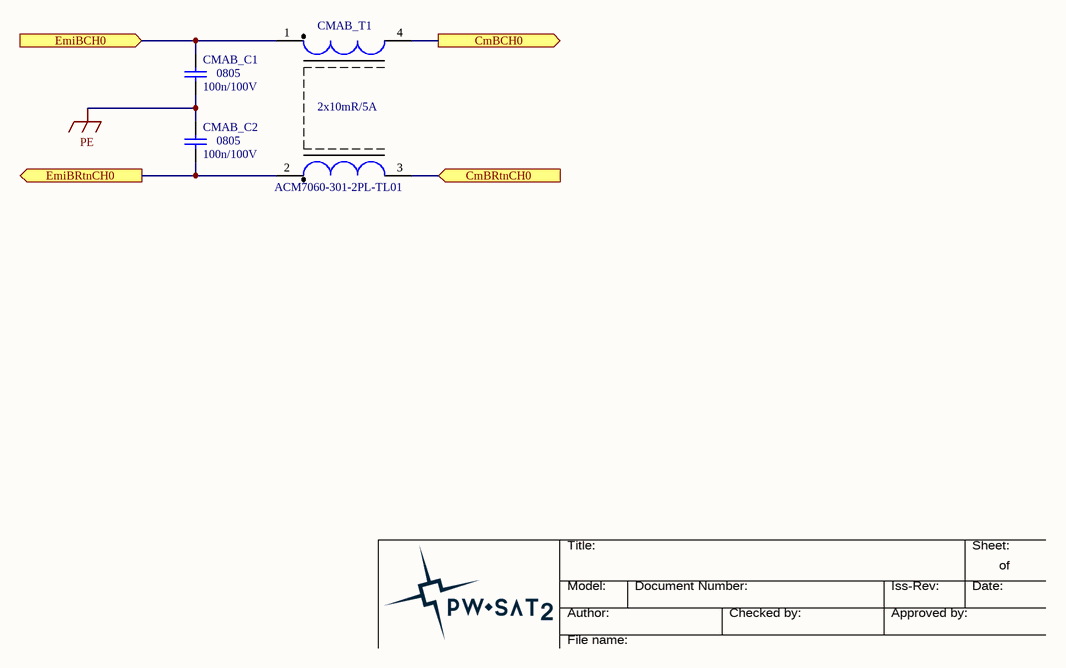
[diagram p7: cm_filter_ch0_b.SchDoc]

### Parts
CMAB_C1  Package: 0805  [SMD_Capacitor_0805]  (hidden comment: 100n/100V)
CMAB_C2  Package: 0805  [SMD_Capacitor_0805]  (hidden comment: 100n/100V)
CMAB_T1  2x10mR/5A  [TDK_ACM7060]

### Ports
CmBCH0 (out), CmBRtnCH0 (in), EmiBCH0 (in), EmiBRtnCH0 (out)

### Nets
DCDCA_GND: CMAB_C2.2 CMAB_T1.2 ; port EmiBRtnCH0
PE: CMAB_C1.2 CMAB_C2.1
NetCMAB_C1_1: CMAB_C1.1 CMAB_T1.1 ; port EmiBCH0
NetCMAB_T1_3: CMAB_T1.3 ; port CmBRtnCH0
NetCMAB_T1_4: CMAB_T1.4 ; port CmBCH0

### Notes on the sheet
- Title:
- Sheet:
- of
- Author:
- Model:
- Document Number:
- Checked by:
- Iss-Rev:
- Approved by:
- Date:
- File name:

### Library data of the parts
CMAB_C1 CMAB_C2 = Cer_C0805T104K1RCLTU: as CMAA_C1 on sheet cm_filter_ch0_a; ManufacturerPartNumber: C0805T104K1RCLTU; Manufacturer: Kemet; Value: 100n/100V
CMAB_T1 = ACM7060-301-2PL-TL01: TDK ACM7060-301 Common Mode Choke; Manufacturer: TDK; ManufacturerPartNumber: ACM7060-301-2PL-TL01; Value: 2x10mR/5A

## Nets that join several sheets
DCDCA_GND: top_power (MPPT_H1.1 MPPT_H1.2), controlled_boost_converter_ch0 (15 pins), cm_filter_ch0_a (CMAA_C2.2 CMAA_T1.3), mppt_interface_ch0 (20 pins), measurement_ch0 (12 pins), emi_filter_ch0_a (EMIAA_C1.2 EMIAA_C2.2), emi_filter_ch0_b (EMIAB_C1.2 EMIAB_C2.2 EMIAB_C3.2), cm_filter_ch0_b (CMAB_C2.2 CMAB_T1.2)
MeasCH0_3V0: top_power (MPPT_H1.8), mppt_interface_ch0 (14 pins), measurement_ch0 (5 pins)
PE: cm_filter_ch0_a (CMAA_C1.2 CMAA_C2.1), cm_filter_ch0_b (CMAB_C1.2 CMAB_C2.1)
ConvCtrl: controlled_boost_converter_ch0 (DCDCA_D2.A), mppt_interface_ch0 (5 pins)
MeasCH0_I: mppt_interface_ch0 (MPPTA_R2.1), measurement_ch0 (MA_U2.2)
MeasCH0_V: mppt_interface_ch0 (MPPTA_C4.1 MPPTA_U2.6 R?#1.1), measurement_ch0 (MA_R2.2 MA_R3.1)
MPPTA_CS_ADC: top_power (MPPT_H1.4), mppt_interface_ch0 (MPPTA_U2.1)
MPPTA_CS_DAC: top_power (MPPT_H1.6), mppt_interface_ch0 (MPPTA_U1.6)
MPPTA_DIN: top_power (MPPT_H1.7), mppt_interface_ch0 (MPPTA_U1.4 MPPTA_U2.8)
MPPTA_DOUT: top_power (MPPT_H1.5), mppt_interface_ch0 (MPPTA_U2.9)
MPPTA_SCLK: top_power (MPPT_H1.3), mppt_interface_ch0 (MPPTA_R1.1 MPPTA_U1.5 MPPTA_U2.10)
NetCMAA_C1_1: cm_filter_ch0_a (CMAA_C1.1 CMAA_T1.4), measurement_ch0 (MA_R1.1 MA_R2.1 MA_R4.1)
NetCMAA_T1_1: top_power (IN_K1.2), cm_filter_ch0_a (CMAA_T1.1)
NetCMAA_T1_2: top_power (IN_K1.1), cm_filter_ch0_a (CMAA_T1.2)
NetCMAB_C1_1: mppt_interface_ch0 (MPPTA_R4.1), emi_filter_ch0_b (EMIAB_C1.1 EMIAB_C2.1 EMIAB_FB1.1 EMIAB_R1.2), cm_filter_ch0_b (CMAB_C1.1 CMAB_T1.1)
NetCMAB_T1_3: top_power (OUT_K1.1), cm_filter_ch0_b (CMAB_T1.3)
NetCMAB_T1_4: top_power (OUT_K1.2), cm_filter_ch0_b (CMAB_T1.4)
NetDCDCA_C1_1: controlled_boost_converter_ch0 (6 pins), emi_filter_ch0_a (EMIAA_L1.1 EMIAA_L2.1 EMIAA_R2.2)
NetDCDCA_C4_1: controlled_boost_converter_ch0 (6 pins), emi_filter_ch0_b (EMIAB_FB1.2)
NetEMIAA_C1_1: measurement_ch0 (MA_R1.4), emi_filter_ch0_a (EMIAA_C1.1 EMIAA_L2.2 EMIAA_R1.1)